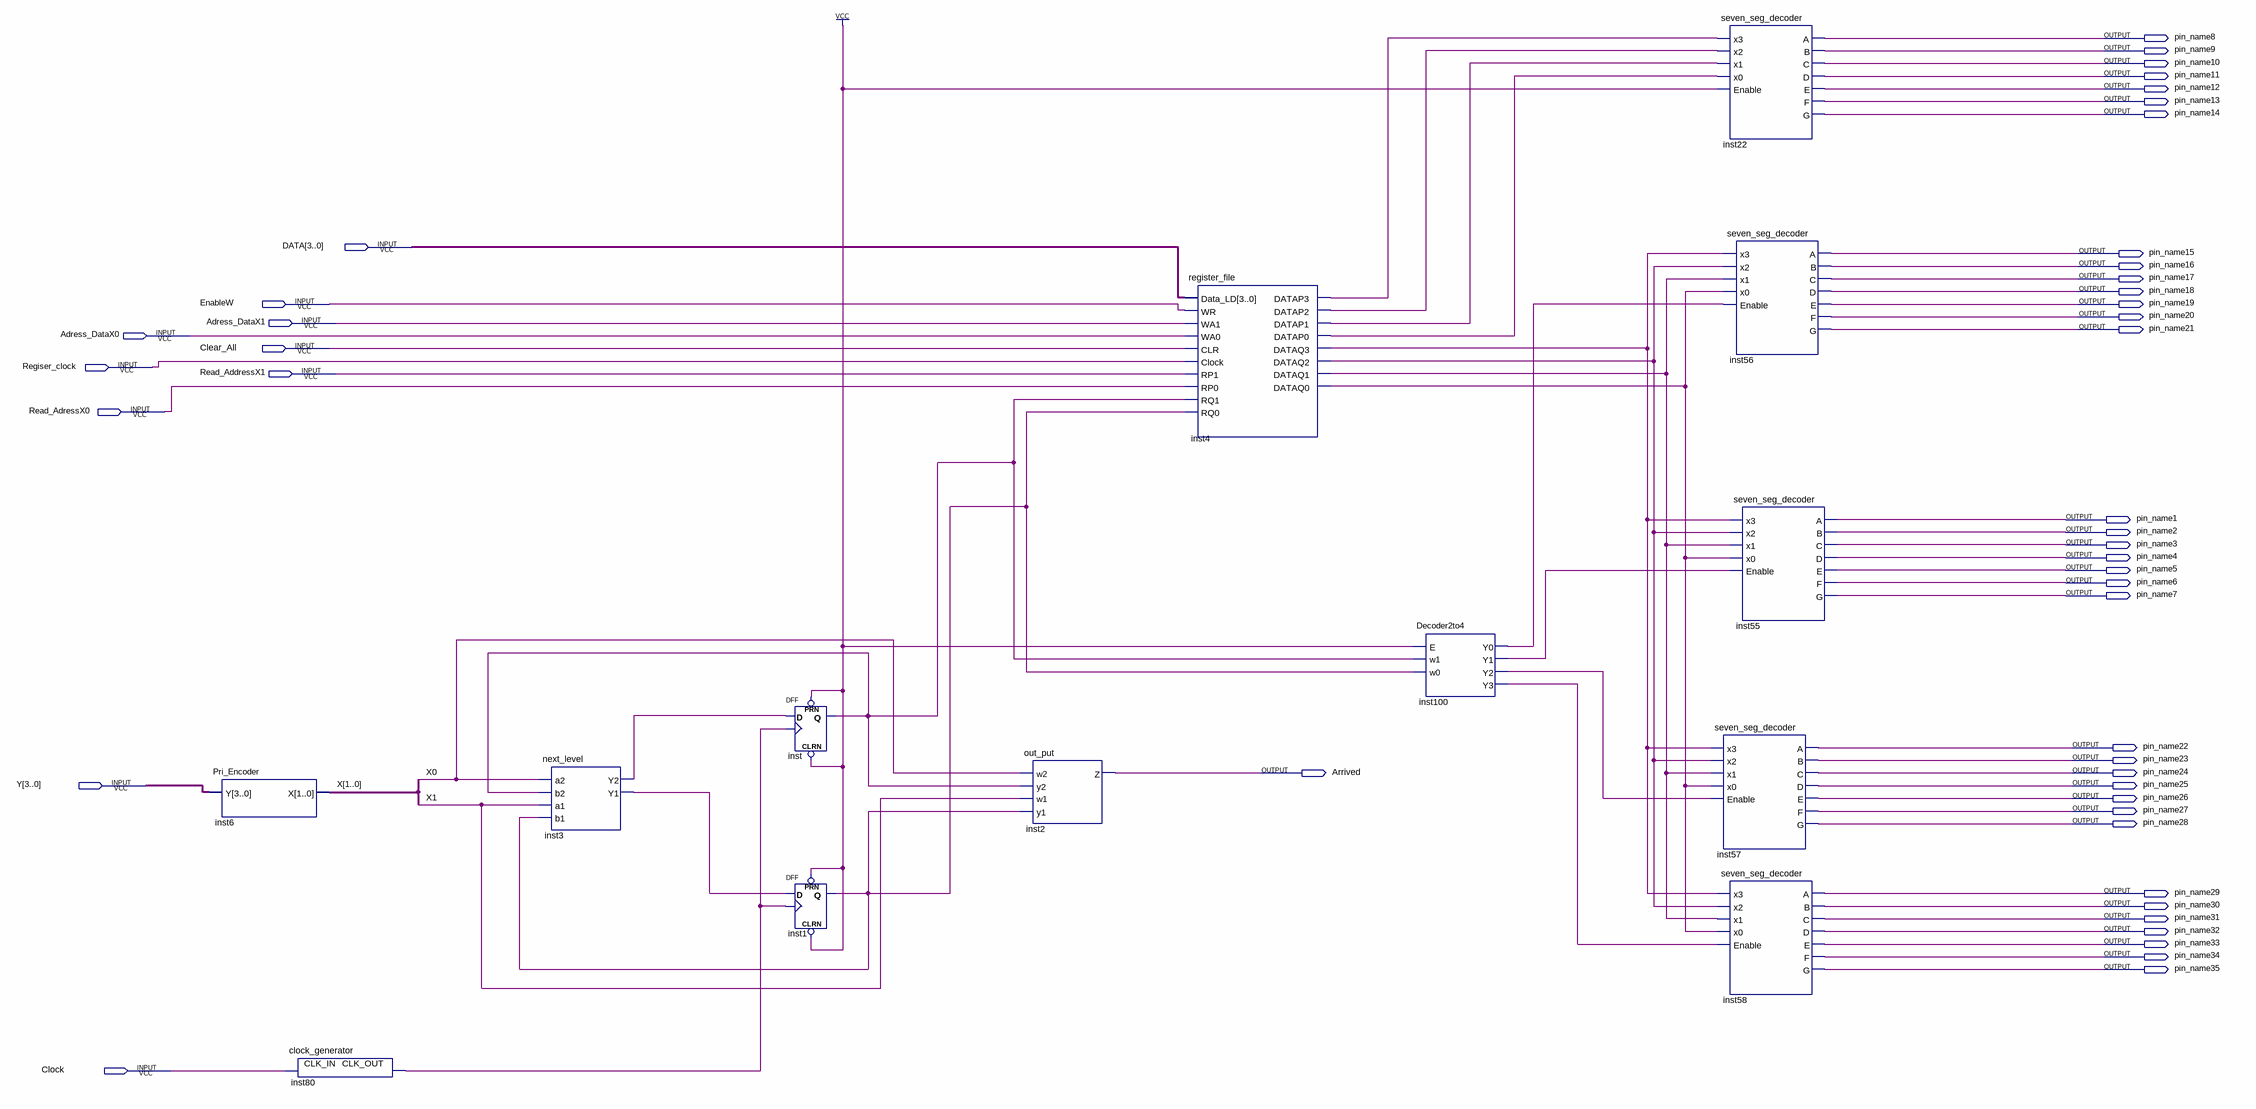
[diagram p0: schematic sheet]
// Quartus schematic ELEVATOR.bdf as structural Verilog: 13 symbols, 46 pins
module ELEVATOR (
  input  [3:0] DATA,
  input  EnableW,
  input  Adress_DataX1,
  input  Adress_DataX0,
  input  Clear_All,
  input  Regiser_clock,
  input  Read_AddressX1,
  input  Read_AdressX0,
  input  [3:0] Y,
  input  Clock,
  output pin_name8,
  output pin_name9,
  output pin_name10,
  output pin_name11,
  output pin_name12,
  output pin_name13,
  output pin_name14,
  output pin_name15,
  output pin_name16,
  output pin_name17,
  output pin_name18,
  output pin_name19,
  output pin_name20,
  output pin_name21,
  output pin_name1,
  output pin_name2,
  output pin_name3,
  output pin_name4,
  output pin_name5,
  output pin_name6,
  output pin_name7,
  output pin_name22,
  output pin_name23,
  output Arrived,
  output pin_name24,
  output pin_name25,
  output pin_name26,
  output pin_name27,
  output pin_name28,
  output pin_name29,
  output pin_name30,
  output pin_name31,
  output pin_name32,
  output pin_name33,
  output pin_name34,
  output pin_name35
);

  wire inst1_q, inst3_y1, inst3_y2, inst4_datap0, inst4_datap1, inst4_datap2, inst4_datap3, inst4_dataq0,
       inst4_dataq1, inst4_dataq2, inst4_dataq3, inst80_clk_out, inst100_y0, inst100_y1, inst100_y2,
       inst100_y3, inst_q;
  wire [1:0] X;

  Pri_Encoder inst6 (.Y(Y), .X(X));
  clock_generator inst80 (.CLK_IN(Clock), .CLK_OUT(inst80_clk_out));
  next_level inst3 (.a2(X[0]), .b2(inst_q), .a1(X[1]), .b1(inst1_q), .Y2(inst3_y2), .Y1(inst3_y1));
  DFF inst (.CLRN(1'b1), .CLK(inst80_clk_out), .D(inst3_y2), .PRN(1'b1), .Q(inst_q));
  DFF inst1 (.CLRN(1'b1), .CLK(inst80_clk_out), .D(inst3_y1), .PRN(1'b1), .Q(inst1_q));
  out_put inst2 (.w2(X[0]), .y2(inst_q), .w1(X[1]), .y1(inst1_q), .Z(Arrived));
  register_file inst4 (
    .Data_LD(DATA), .WR(EnableW), .WA1(Adress_DataX1), .WA0(Adress_DataX0), .CLR(Clear_All),
    .Clock(Regiser_clock), .RP1(Read_AddressX1), .RP0(Read_AdressX0), .RQ1(inst_q), .RQ0(inst1_q),
    .DATAP3(inst4_datap3), .DATAP2(inst4_datap2), .DATAP1(inst4_datap1), .DATAP0(inst4_datap0),
    .DATAQ3(inst4_dataq3), .DATAQ2(inst4_dataq2), .DATAQ1(inst4_dataq1), .DATAQ0(inst4_dataq0));
  Decoder2to4 inst100 (
    .E(1'b1), .w1(inst_q), .w0(inst1_q), .Y0(inst100_y0), .Y1(inst100_y1), .Y2(inst100_y2), .Y3(inst100_y3));
  seven_seg_decoder inst22 (
    .x3(inst4_datap3), .x2(inst4_datap2), .x1(inst4_datap1), .x0(inst4_datap0), .Enable(1'b1), .A(pin_name8),
    .B(pin_name9), .C(pin_name10), .D(pin_name11), .E(pin_name12), .F(pin_name13), .G(pin_name14));
  seven_seg_decoder inst57 (
    .x3(inst4_dataq3), .x2(inst4_dataq2), .x1(inst4_dataq1), .x0(inst4_dataq0), .Enable(inst100_y2),
    .A(pin_name22), .B(pin_name23), .C(pin_name24), .D(pin_name25), .E(pin_name26), .F(pin_name27),
    .G(pin_name28));
  seven_seg_decoder inst58 (
    .x3(inst4_dataq3), .x2(inst4_dataq2), .x1(inst4_dataq1), .x0(inst4_dataq0), .Enable(inst100_y3),
    .A(pin_name29), .B(pin_name30), .C(pin_name31), .D(pin_name32), .E(pin_name33), .F(pin_name34),
    .G(pin_name35));
  seven_seg_decoder inst56 (
    .x3(inst4_dataq3), .x2(inst4_dataq2), .x1(inst4_dataq1), .x0(inst4_dataq0), .Enable(inst100_y0),
    .A(pin_name15), .B(pin_name16), .C(pin_name17), .D(pin_name18), .E(pin_name19), .F(pin_name20),
    .G(pin_name21));
  seven_seg_decoder inst55 (
    .x3(inst4_dataq3), .x2(inst4_dataq2), .x1(inst4_dataq1), .x0(inst4_dataq0), .Enable(inst100_y1),
    .A(pin_name1), .B(pin_name2), .C(pin_name3), .D(pin_name4), .E(pin_name5), .F(pin_name6), .G(pin_name7));
endmodule
